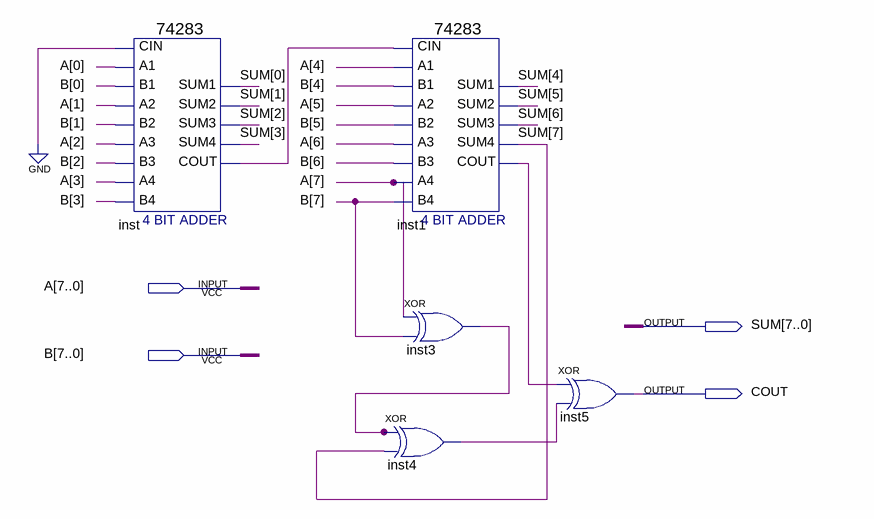
[diagram p0: schematic sheet]
// Quartus schematic adder8.bdf as structural Verilog: 5 symbols, 4 pins
module adder8 (
  input  [7:0] A,
  input  [7:0] B,
  output [7:0] SUM,
  output COUT
);

  wire inst1_cout, inst3_out, inst4_out, inst_cout;

  \74283  inst (
    .CIN(1'b0), .A1(A[0]), .A2(A[1]), .B2(B[1]), .A3(A[2]), .A4(A[3]), .B4(B[3]), .B1(B[0]), .B3(B[2]),
    .SUM4(SUM[3]), .COUT(inst_cout), .SUM1(SUM[0]), .SUM2(SUM[1]), .SUM3(SUM[2]));
  xor inst4 (inst4_out, inst3_out, SUM[7]);
  \74283  inst1 (
    .CIN(inst_cout), .A1(A[4]), .A2(A[5]), .B2(B[5]), .A3(A[6]), .A4(A[7]), .B4(B[7]), .B1(B[4]), .B3(B[6]),
    .SUM4(SUM[7]), .COUT(inst1_cout), .SUM1(SUM[4]), .SUM2(SUM[5]), .SUM3(SUM[6]));
  xor inst3 (inst3_out, A[7], B[7]);
  xor inst5 (COUT, inst1_cout, inst4_out);
endmodule
